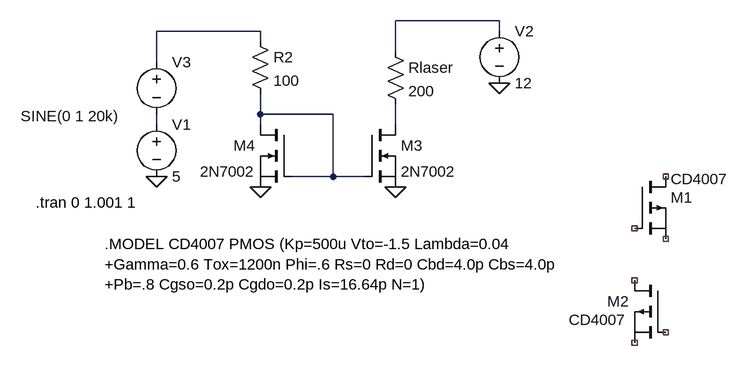
[diagram p0: schematic laser_driver.asc]
laser_driver.asc, the LTspice schematic file:
Version 4
SHEET 1 1504 680
WIRE 544 -112 384 -112
WIRE 176 -96 16 -96
WIRE 544 -96 544 -112
WIRE 176 -80 176 -96
WIRE 384 -64 384 -112
WIRE 16 -48 16 -96
WIRE 176 32 176 0
WIRE 288 32 176 32
WIRE 16 48 16 32
WIRE 176 48 176 32
WIRE 384 48 384 16
WIRE 288 128 288 32
WIRE 288 128 224 128
WIRE 336 128 288 128
FLAG 176 144 0
FLAG 384 144 0
FLAG 544 -16 0
FLAG 16 128 0
SYMBOL pmos 752 128 R0
WINDOW 3 56 4 Left 2
SYMATTR Value CD4007
SYMATTR InstName M1
SYMBOL pmos 800 288 M0
WINDOW 3 61 61 Left 2
SYMATTR Value CD4007
SYMATTR InstName M2
SYMBOL res 368 -80 R0
SYMATTR InstName Rlaser
SYMATTR Value 200
SYMBOL res 160 -96 R0
SYMATTR InstName R2
SYMATTR Value 100
SYMBOL voltage 544 -112 R0
WINDOW 123 0 0 Left 0
WINDOW 39 0 0 Left 0
SYMATTR InstName V2
SYMATTR Value 12
SYMBOL voltage 16 32 R0
WINDOW 123 0 0 Left 0
WINDOW 39 0 0 Left 0
SYMATTR InstName V1
SYMATTR Value 5
SYMBOL voltage 16 -64 R0
WINDOW 3 -209 99 Left 2
WINDOW 123 0 0 Left 0
WINDOW 39 0 0 Left 0
SYMATTR InstName V3
SYMATTR Value SINE(0 1 20k)
SYMBOL nmos 336 48 R0
SYMATTR InstName M3
SYMATTR Value 2N7002
SYMBOL nmos 224 48 M0
SYMATTR InstName M4
SYMATTR Value 2N7002
TEXT -64 232 Left 2 !.MODEL CD4007 PMOS (Kp=500u Vto=-1.5 Lambda=0.04 \n+Gamma=0.6 Tox=1200n Phi=.6 Rs=0 Rd=0 Cbd=4.0p Cbs=4.0p \n+Pb=.8 Cgso=0.2p Cgdo=0.2p Is=16.64p N=1)
TEXT -170 168 Left 2 !.tran 0 1.001 1

The netlist it stands for:
* laser_driver.asc
M1 NC_01 NC_02 NC_03 NC_03 CD4007
M2 NC_04 NC_05 NC_06 NC_06 CD4007
Rlaser N001 N005 200
R2 N002 N003 100
V2 N001 0 12
V1 N004 0 5
V3 N002 N004 SINE(0 1 20k)
M3 N005 N003 0 0 2N7002
M4 N003 N003 0 0 2N7002
.model NMOS NMOS
.model PMOS PMOS
.lib standard.mos
.MODEL CD4007 PMOS (Kp=500u Vto=-1.5 Lambda=0.04
+Gamma=0.6 Tox=1200n Phi=.6 Rs=0 Rd=0 Cbd=4.0p Cbs=4.0p
+Pb=.8 Cgso=0.2p Cgdo=0.2p Is=16.64p N=1)
.tran 0 1.001 1
.backanno
.end